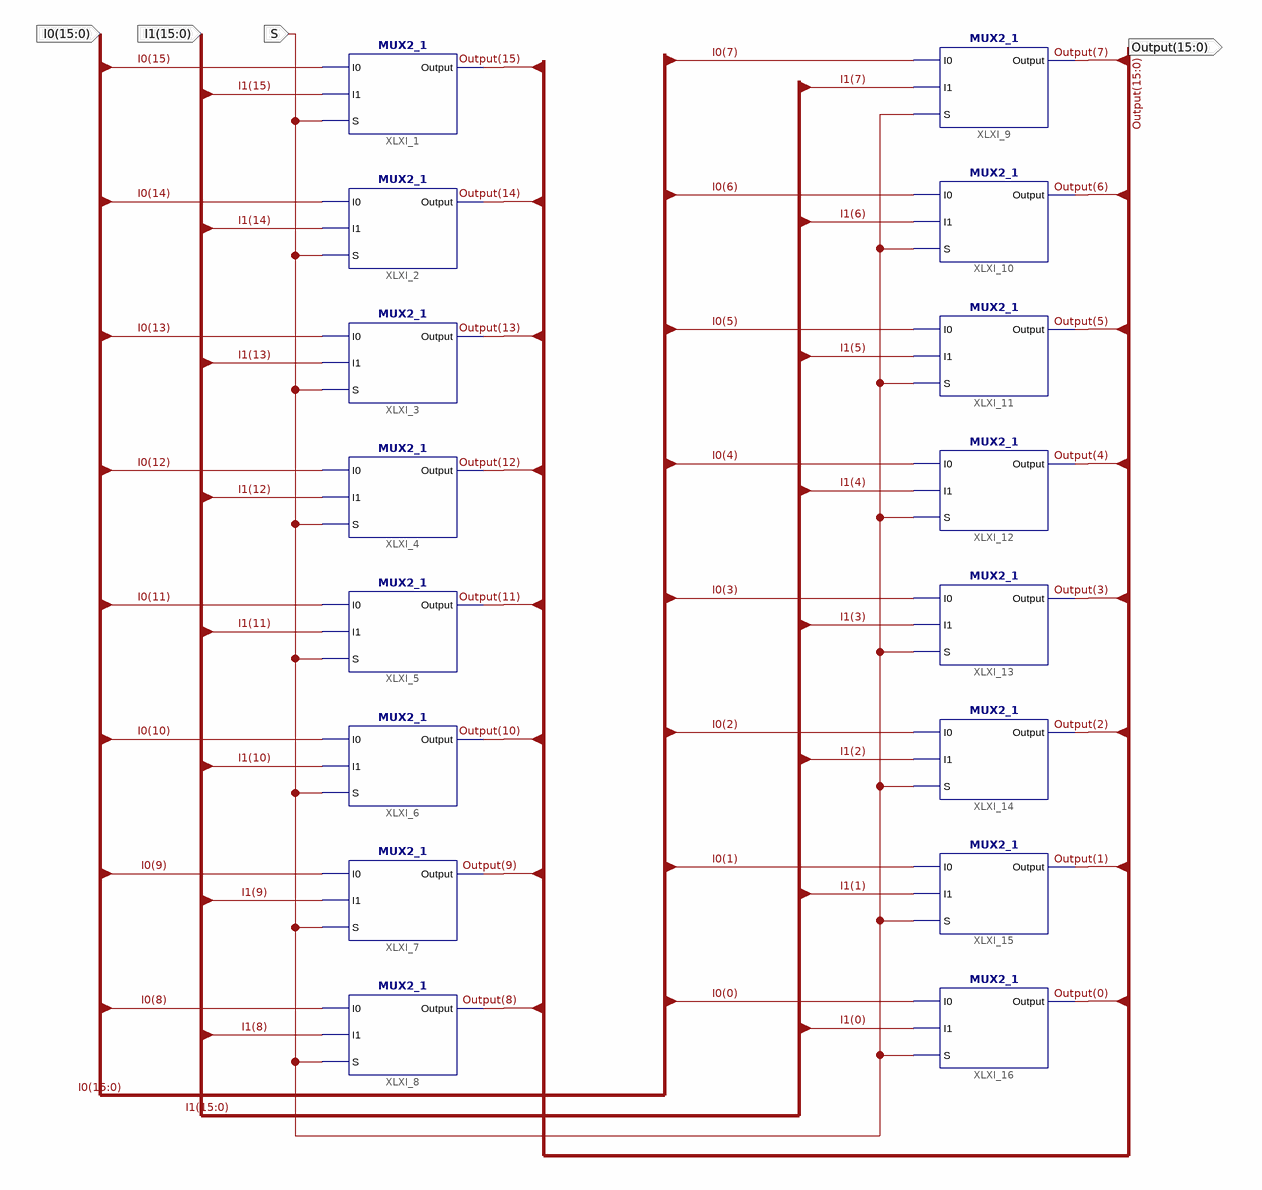
[diagram p0: schematic sheet 1]
// Xilinx ISE schematic MUX2_1_16bits.sch (virtex6) as structural Verilog: 16 symbols, 4 ports
module MUX2_1_16bits (
  input  [15:0] I0,
  input  [15:0] I1,
  input  S,
  output [15:0] Output
);

  MUX2_1 XLXI_1 (.I0(I0[15]), .I1(I1[15]), .Output(Output[15]), .S(S));
  MUX2_1 XLXI_2 (.I0(I0[14]), .I1(I1[14]), .Output(Output[14]), .S(S));
  MUX2_1 XLXI_3 (.I0(I0[13]), .I1(I1[13]), .Output(Output[13]), .S(S));
  MUX2_1 XLXI_4 (.I0(I0[12]), .I1(I1[12]), .Output(Output[12]), .S(S));
  MUX2_1 XLXI_5 (.I0(I0[11]), .I1(I1[11]), .Output(Output[11]), .S(S));
  MUX2_1 XLXI_6 (.I0(I0[10]), .I1(I1[10]), .Output(Output[10]), .S(S));
  MUX2_1 XLXI_7 (.I0(I0[9]), .I1(I1[9]), .Output(Output[9]), .S(S));
  MUX2_1 XLXI_8 (.I0(I0[8]), .I1(I1[8]), .Output(Output[8]), .S(S));
  MUX2_1 XLXI_9 (.I0(I0[7]), .I1(I1[7]), .Output(Output[7]), .S(S));
  MUX2_1 XLXI_10 (.I0(I0[6]), .I1(I1[6]), .Output(Output[6]), .S(S));
  MUX2_1 XLXI_11 (.I0(I0[5]), .I1(I1[5]), .Output(Output[5]), .S(S));
  MUX2_1 XLXI_12 (.I0(I0[4]), .I1(I1[4]), .Output(Output[4]), .S(S));
  MUX2_1 XLXI_13 (.I0(I0[3]), .I1(I1[3]), .Output(Output[3]), .S(S));
  MUX2_1 XLXI_14 (.I0(I0[2]), .I1(I1[2]), .Output(Output[2]), .S(S));
  MUX2_1 XLXI_15 (.I0(I0[1]), .I1(I1[1]), .Output(Output[1]), .S(S));
  MUX2_1 XLXI_16 (.I0(I0[0]), .I1(I1[0]), .Output(Output[0]), .S(S));
endmodule
